# EAGLE design ADXL345 STEMMA QT (EAGLE 9.6.2)
COMPANY: ADAFRUIT INDUSTRIES; DRAWN: KTOWN; REV: A
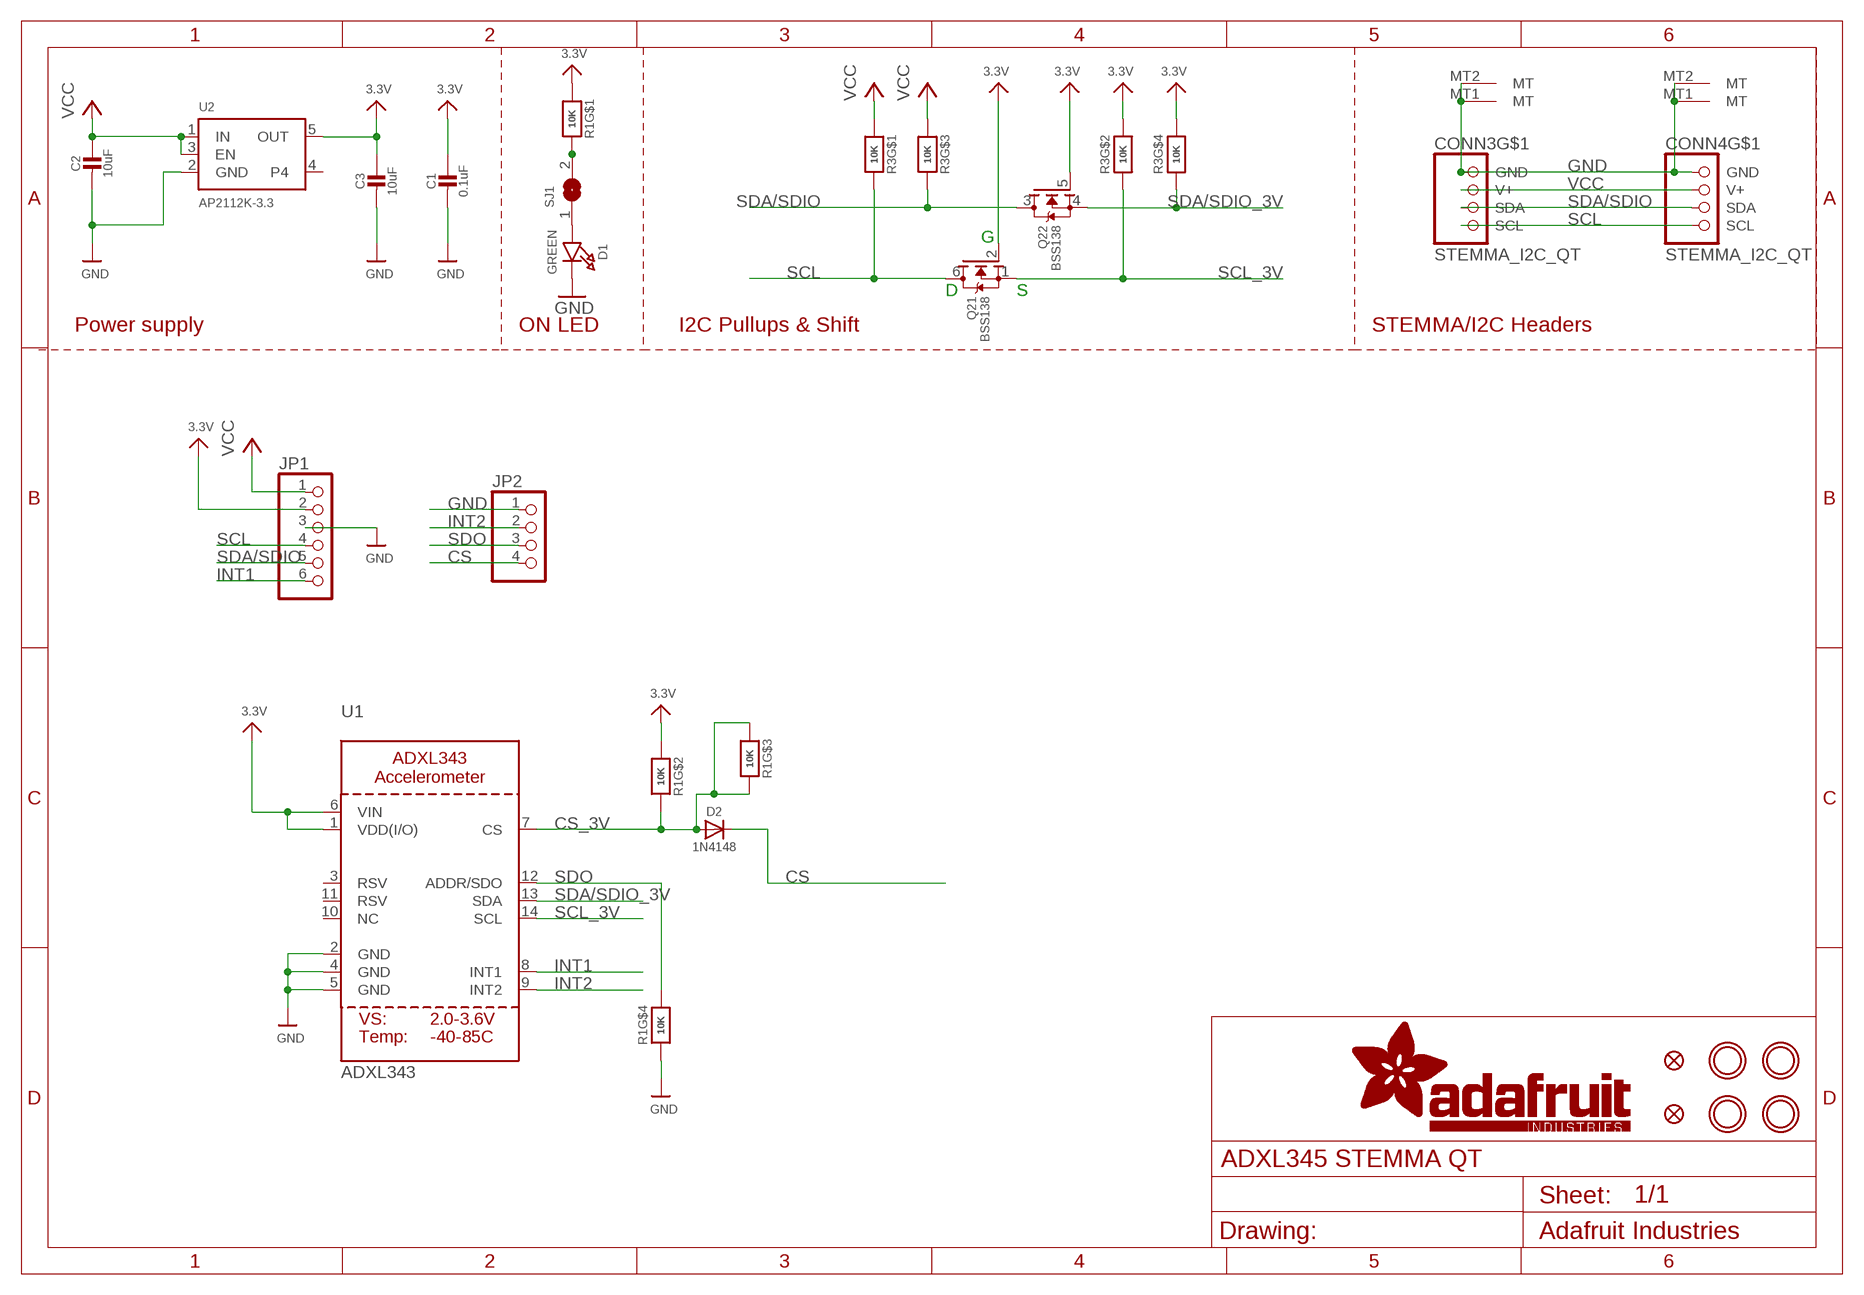
[diagram p0: schematic, sheet 1]

## Parts
C1  0.1uF  CAP_CERAMIC0603_NO  [0603-NO]
C2  10uF  CAP_CERAMIC_0805MP  [_0805MP]
C3  10uF  CAP_CERAMIC0805-NOOUTLINE  [0805-NO]
CONN3  STEMMA_I2C_QT  [JST_SH4]
CONN4  STEMMA_I2C_QT  [JST_SH4]
D1  GREEN  LED0603_NOOUTLINE  [CHIPLED_0603_NOOUTLINE]
D2  1N4148  DIODESOD-323  [SOD-323]
FID3  FIDUCIAL_1MM  [FIDUCIAL_1MM]
FID4  FIDUCIAL_1MM  [FIDUCIAL_1MM]
JP1  HEADER-1X670MIL  [1X06_ROUND_70]
JP2  HEADER-1X4ROUND  [1X04_ROUND]
Q2  BSS138  MOSFET-N_DUAL  [SOT363]
R1  10K  RESISTOR_4PACK  [RESPACK_4X0603]
R3  10K  RESISTOR_4PACK  [RESPACK_4X0603]
SJ1  SOLDERJUMPERCLOSED  [SOLDERJUMPER_CLOSEDWIRE]
U1  ADXL343  ACCEL_ADXL343  [LGA14]
U2  AP2112K-3.3  VREG_SOT23-5  [SOT23-5]
U$1  MOUNTINGHOLE2.5  [MOUNTINGHOLE_2.5_PLATED]
U$17  MOUNTINGHOLE2.5  [MOUNTINGHOLE_2.5_PLATED]
U$19  MOUNTINGHOLE2.5  [MOUNTINGHOLE_2.5_PLATED]
U$21  MOUNTINGHOLE2.5  [MOUNTINGHOLE_2.5_PLATED]

## Nets
3.3V [lowpower]: C1.1 C3.1 JP1.2 Q2.2(1:G) Q2.5(2:G) R1.1 R1.2 R3.2 R3.4 U1.1(VDD(I/O)) U1.6(VIN) U2.5(OUT)
CS: D2.C JP2.4
CS_3V: D2.A R1.3 R1.6 R1.7 U1.7(CS)
GND [highpower]: C1.2 C2.2 C3.2 CONN3.1(GND) CONN3.MT1(MT) CONN3.MT2(MT) CONN4.1(GND) CONN4.MT1(MT) CONN4.MT2(MT) D1.C JP1.3 JP2.1 R1.4 U1.2(GND) U1.4(GND) U1.5(GND) U2.2(GND)
INT1: JP1.6 U1.8(INT1)
INT2: JP2.2 U1.9(INT2)
N$1: R1.8 SJ1.2
N$2: D1.A SJ1.1
SCL: CONN3.4(SCL) CONN4.4(SCL) JP1.4 Q2.6(1:D) R3.8
SCL_3V: Q2.1(1:S) R3.7 U1.14(SCL)
SDA/SDIO: CONN3.3(SDA) CONN4.3(SDA) JP1.5 Q2.3(2:D) R3.6
SDA/SDIO_3V: Q2.4(2:S) R3.5 U1.13(SDA)
SDO: JP2.3 R1.5 U1.12(ADDR/SDO)
VCC [highpower]: C2.1 CONN3.2(V+) CONN4.2(V+) JP1.1 R3.1 R3.3 U2.1(IN) U2.3(EN)
Unconnected: U1.3(RSV) U1.10(NC) U1.11(RSV) U2.4

## Notes on the sheet
- G
- D | S
- Power supply | ON LED | I2C Pullups & Shift | STEMMA/I2C Headers

## Library data of the parts
C1-C3 = microbuilder:CAP_CERAMIC: Ceramic Capacitors For new designs, use the packages preceded by an '_' character since they are more reliable: The following footprints should be used on most boards: _0402 - Standard footprint for regular board layouts _0603 - Standard footprint for regular board layouts _0805 - Standard footprint for regular board layouts _1206 - Standard footprint for regular board layouts For extremely tight-pitch boards where space is at a premium, the following 'micro-pitch' footprints can be used (smaller pads, no silkscreen outline, etc.): _0402MP - Micro-pitch footprint for very dense/compact boards _0603MP - Micro-pitch footprint for very dense/compact boards _0805MP - Micro-pitch footprint for very dense/compact boards _1206MP - Micro-pitch footprint for very dense/compact boards
CONN3 CONN4 = microbuilder:STEMMA_I2C
D1 = microbuilder:LED: LED 0603 - 0603 Surface Mount Package 2mA: Green LED - Low Power (3.9mcd, 2ma, 1.7Vf) - Digikey: 475-2709-2-ND Orange LED - Low Power (9.8mcd, 2ma, 1.8Vf) - Digikey: 475-1194-2-ND Red LED - Low Power (5mcd, 2ma, 1.8Vf) - Digikey: 475-1195-2-ND Yellow LED - Low Power (7mcd, 2ma, 1.8Vf) - Digikey: 475-1196-2-ND 5mA: Blue LED - Low Power (17mcd, 5ma, 2.9Vf) - Digikey: LNJ937W8CRACT-ND 0805 - 0805 Surface Mount Package 2mA: Red LED (8.8mcd, 2mA, 1.8Vf, Clear) - Low Power [Digikey: 475-2510-1-ND] Green LED (5mcd, 2mA, 1.8Vf, Clear) - Low Power [Digikey: 475-2730-1-ND] Yellow LED (11.3mcd, 2mA, 1.8Vf, Clear) - Low Power [Digikey: 475-2555-1-ND] 20mA: Red LED (104mcd, 20mA, Diffused) - LS R976 [Digikey: 475-1278-6-ND] Red LED (12mcd, 20mA, 2.0Vf, Clear) - APT2012EC [Digikey: 754-1128-1-ND] Green LED (15mcd, 20mA, 2.2Vf, Clear) - APT2012GC [Digikey: 754-1131-1-ND] Orange LED (160mcd, 20mA, 2.1Vf, Clear) - APT2012SECK [Digikey: 754-1130-1-ND] 1206 - 1206 Surface Mount Package Green LED (26mcd, 20mA, Diffused) - LG N971 [Digikey: 475-1407-6-ND] Red LED (15mcd, 20mA, Diffused) - LH N974 [Digikey: 475-1416-6-ND] Cree - Cree High-Power Surface Mount LEDs XPEBWT-L1-0000-00D50 - White 111lm 350mA 2.9Vf 6200K 110° XTEAWT-00-0000-00000LEE3 - White 114lm 350mA 2.85Vf 5000K 115° Everlight - Everlight 45-21 Series Surface Mount LEDs 45-21/QK2C-B2832AC2CB2/2T - Warm White 2000mcd 20mA 3.25Vf 3050K 120° 45-21/LK2C-B38452C4CB2/2T - Nuetral White 2000mcd 20mA 3.25Vf 4150K 120° 45-21/LK2C-B50634C6CB2/2T - Cold White 2200mcd 20mA 3.25Vf 5650K 120° PLCC2 Reverse Mount LS T77K-J1L2-1-0-2-R18-Z - Red 11.25mcd 2mA 1.8Vf 630nm 120° LO T77K-L1M2-24-Z - Orange 19.6mcd 2mA 1.8Vf 606nm 120° LY T77K-K2M1-26-Z - Yellow 15.7mcd 2mA 1.8Vf 587nm 120°
D2 = microbuilder:DIODE: Diode SMA Model Volts Amps Type Vf Ir Digikey # Notes SSA34-E3 40V 3A Schottky 480mV @ 3A 200uA @ 40V SSA34-E3/61TGITR-ND CDBA120-G 20V 1A Schottky 500mV @ 1A 500uA @ 20V 641-1014-6-ND REEL MBRA210 10V 2A Schottky 350mV @ 2A 700uA @ 10V MBRA210LT3 SOD-123 Model Volts Amps Type Vf Ir Order # Notes BAT54T1G 30V 200mA Schottky 800mV @ 200mA 2uA @ 25V BAT54T1GOSTR-ND B0530W 30V 500mA Schottky 430mV @ 500mA 130uA @ 30V B0530W-FDICT-ND REEL MBR120 20V 1A Schottky 340mV @ 1A MBR120VLSFT1GOSCT-ND SOD-323 Model Volts Amps Type Vf Ir Order # Notes PMEG2005EJ 20V 500mA Schottky 355mV @ 500mA 568-4110-1-ND ZLLS410 10V 570mA Schottky 380mV @ 570mA ZLLS410CT-ND 1N4148WS 75V 150mA Silicon/Simple 1V 1N4148WSFSCT-ND REEL SOD-523 Model Volts Amps Type Vf Ir Order # Notes BAT54XV2 30V 200mA Schottky 0.8V @ 100mA BAT54XV2CT-ND TB751S 30V 30mA Schottky RB751S-40TE61CT-ND SOT23-R/W (R = Solder Paste/Reflow Ovens, W = Hand-Soldering) Model Volts Amps Type Vf Ir Order # Notes BAT54FILM 40V 300mA Schottky 497-7162-1-ND POWERDI-5 Model Volts Amps Type Vf Ir Order # Notes PDS560 60V 5A Schottky 670mV @ 5A 150uA @ 60V PDS560DICT-ND
FID3 FID4 = microbuilder:FIDUCIAL: Fiducial Alignment Points Various fiducial points for machine vision alignment.; BOM: EXCLUDE
JP1 = microbuilder:HEADER-1X6: PIN HEADER
JP2 = microbuilder:HEADER-1X4: PIN HEADER
Q2 = microbuilder:MOSFET-N_DUAL: Dual N-Channel MOSFET SOT363 (2.0x1.25mm) 2N7002PS - 60V, 320mA [Digikey: 568-5984-1-ND]
R1 R3 = microbuilder:RESISTOR_4PACK: Resistor Packs (4 resistors) 4 x 0603 10K 1/16W - Digikey: YC164J-10KCT-ND
SJ1 = microbuilder:SOLDERJUMPER: SMD Solder JUMPER Solder the two pads together to create a connection, or remove the solder to break it. REFLOW - Use this footprint for solder paste and reflow ovens. WAVE - Use this footprint for hand-soldering (larger pads). CLOSED - Has a trace between the two pads to ensure it is closed by default. The trace needs to be cut to disable the jumper, and can be closed again by creating a solder bridge between the two pads.
U1 = microbuilder:ACCEL_ADXL343: ADXL343 - Digital Accelerometer 2/4/8/16g
U2 = adafruit_power:VREG_SOT23-5: SOT23-5 Fixed Voltage Regulators Part Current Out V Out V In V Dropout θJA (°C/W) TJ (°C) Digikey Part No. ADP121 150mA 3.3V 3.4-5.5V 0.09V @ 150mA -- -- ADP121-AUJZ33R7CT-ND ADP121 150mA 3.0V 3.1-5.5V 0.09V @ 150mA -- -- ADP121-AUJZ30R7CT-ND ADP122 300mA 3.3V 3.4-5.5V 0.085V @ 300mA -- -- ADP122AUJZ-3.3-R7CT-ND ADP1712 300mA 3.3V 3.5-5.5V 0.17V @ 300mA -- -- ADP1712AUJZ-3.3-R7TR-ND AP7311 (Low Cost) 150mA 3.3V 3.5-6V 0.15V @ 150mA -- -- AP7311-33WG-7DICT-ND LD39015M18R 150mA 1.8V 1.9V-5.5V 0.08V @ 100mA -- -- 497-6977-1-ND LP2985A-33DBVR 150mA 3.3V 3.3-16V 0.28V @ 150mA 206 150 296-18479-1-ND MCP1824T-3302E/OT 300mA 3.3V 3.5V-6V 0.2V @ 300mA -- -- MCP1824T-3302E/OTCT-ND MIC5205-2.5YM5 TR 150mA 2.5V 2.7-16V 0.165V @ 150mA -- -- 576-1257-2-ND MIC5205-3.0YM5 TR 150mA 3.0V 3.2V-16V 0.165V @ 150mA -- -- 576-1258-2-ND MIC5205-3.3YM5 TR 150mA 3.3V 3.5V-16V 0.165V @ 150mA -- -- 576-1259-2-ND TPS780330220 150mA 3.3V+2.2V 3.6-5.5V 250mV Max -- -- 296-23332-1-ND TDA3663/N1,135 100mA 3.3V 3.5-45V 0.18V @ 50mA -- -- 568-5343-1-ND Max operating temp can be calculated using θJA, TJ (max junction temperature), and power in watts. Set the "Maximum Ambient Temperature" until it reaches TJ ("Max Junction Temperature"), which is the absolute limit for safe use of the regulator: Heat Sink Temperature Calculator <http://www.daycounter.com/Calculators/Heat-Sink-Temperature-Calculator.phtml> For example, With 12V source into a 3.3V LP2985 and a 30mA load, we are dissipating (12V-3.3V) * 0.03A = 0.261W. With a θJA of 206 °C/W, a TJ of 150°C, and 261mW we can safely use the chip without a heat sink up to 75°C (=147.1°C Junction Temperature).
U$1 U$17 U$19 U$21 = adafruit_electromech:MOUNTINGHOLE: Mounting Hole For #2 screws (0.086"/2.18mm width, 0.094"/2.4mm hole) use 2.5mm; BOM: EXCLUDE

## Net classes
1 highpower: width 0.305 mm, drill 0.483 mm
2 lowpower: width 0.254 mm, drill 0.483 mm

## Board
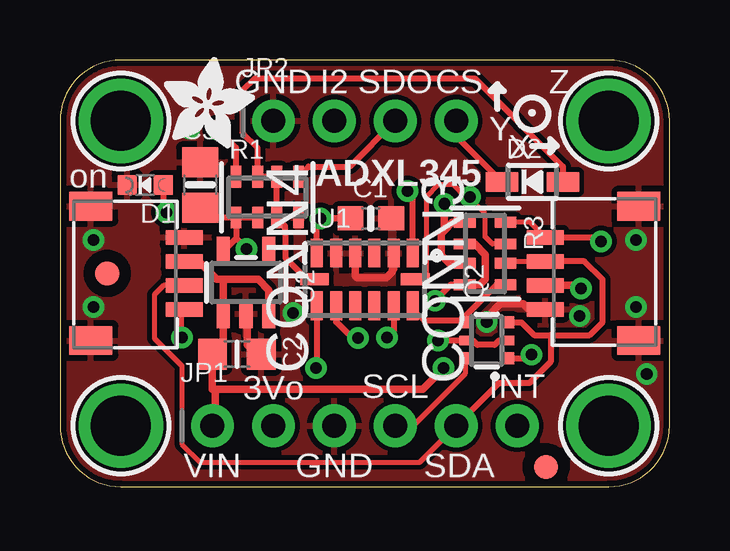
[diagram p1: board, top side]
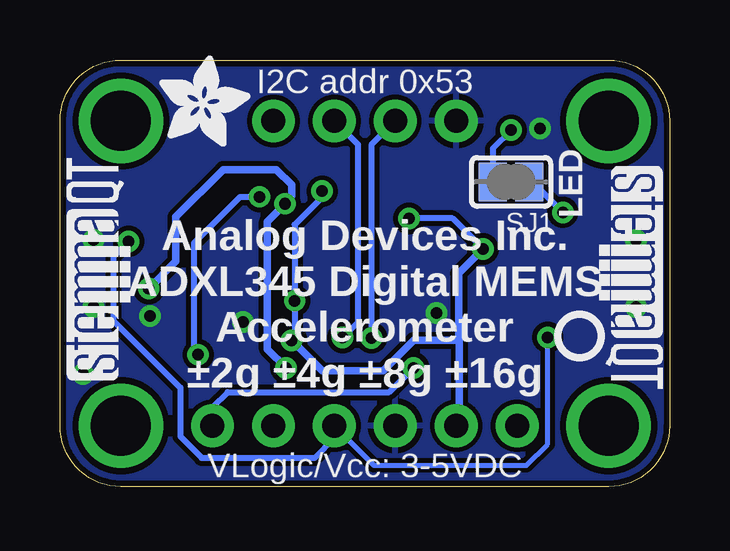
[diagram p2: board, bottom side, seen from below]

Size 25.4 x 17.78 mm. Coordinates in mm from the lower left corner, seen from the top.
Outline: 0,15.24 0,2.54 arc90 2.54,0 22.86,0 arc90 25.4,2.54 25.4,15.24 arc90 22.86,17.78 2.54,17.78 arc90 0,15.24
Copper layers (1*16): Top 0.035mm / dielectric 1.5mm / Bottom 0.035mm
Design rules "adafruit *": minimum track width 8mil, minimum drill 15.5mil, track to track 8mil, track to pad 8mil, pad to pad 8mil, via to via 8mil, smd to smd 8mil, copper to edge 10mil, drill to drill 8mil, minimum pad ring 10mil, minimum via ring 8mil, stop-mask expansion 2mil, vias tented up to drill 20mil, thermal gap 10mil

### Footprints (pad centres in the part's own frame; a part is rotated, then mirrored left to right if it is on the bottom)
0603-NO = smd 1.075 x 1: 1 -0.85,0; 2 0.85,0
_0805MP = smd 1.2 x 1.3: 1 -1.016,0; 2 1.016,0
0805-NO = smd 1.24 x 1.5: 1 -0.95,0; 2 0.95,0
JST_SH4 = smd 0.6 x 1.55: 1 -1.5,2.514; 2 -0.5,2.514; 3 0.5,2.514; 4 1.5,2.514 | smd 1.2 x 1.8: MT1 -2.8,-1.386; MT2 2.8,-1.386
CHIPLED_0603_NOOUTLINE = smd 0.8 x 0.8: A 0,-0.75; C 0,0.75
SOD-323 = smd 1.35 x 0.8: A 1.27,0; C -1.27,0
FIDUCIAL_1MM = smd 1 x 1: 1 0,0
1X06_ROUND_70 = drill 1 pad 1.778: 1 -6.35,0; 2 -3.81,0; 3 -1.27,0; 4 1.27,0; 5 3.81,0; 6 6.35,0
1X04_ROUND = drill 1 pad 1.778: 1 -3.81,0; 2 -1.27,0; 3 1.27,0; 4 3.81,0
SOT363 = smd 0.5 x 0.5: 1 -0.75,-0.9; 3 0.75,-0.9; 4 0.75,0.9; 6 -0.75,0.9 | smd 0.4 x 0.5: 2 0,-0.9; 5 0,0.9
RESPACK_4X0603 = smd 0.45 x 0.9: 1 -1.3,-0.85; 2 -0.4,-0.85; 3 0.4,-0.85; 4 1.3,-0.85; 5 1.3,0.85; 6 0.4,0.85; 7 -0.4,0.85; 8 -1.3,0.85
SOLDERJUMPER_CLOSEDWIRE = smd 1.168 x 1.6: 1 -0.762,0; 2 0.762,0 | smd 0.635 x 0.203: WIRE 0,0
LGA14 = smd 0.5 x 1.2: 1 2,1.1; 2 1.2,1.1; 3 0.4,1.1; 4 -0.4,1.1; 5 -1.2,1.1; 6 -2,1.1; 8 -2,-1.1; 9 -1.2,-1.1; 10 -0.4,-1.1; 11 0.4,-1.1; 12 1.2,-1.1; 13 2,-1.1 | smd 1.2 x 0.5: 7 -2.1,0; 14 2.1,0
SOT23-5 = smd 0.55 x 1.2: 1 -0.95,-1.3; 2 0,-1.3; 3 0.95,-1.3; 4 0.95,1.3; 5 -0.95,1.3
MOUNTINGHOLE_2.5_PLATED = drill 2.5 pad 3.2: P$1 0,0

### Placement (x,y rotation side)
C1  12.95,11.18 0 top
C2  7.37,5.52 0 top
C3  5.84,12.57 90 top
CONN3  22.73,8.89 90 top
CONN4  2.67,8.89 270 top
D1  3.56,12.57 90 top
D2  19.68,12.7 0 top
FID3  20.26,0.83 0 top
FID4  1.97,8.89 0 top
JP1  12.7,2.54 0 top
JP2  12.7,15.24 0 top
Q2  17.78,6.1 90 top
R1  8.64,12.06 0 top
R3  17.72,9.72 270 top
SJ1  6.6,12.7 180 bottom
U1  12.7,8.64 0 top
U2  7.75,8.51 0 top
U$1  2.54,15.24 0 top
U$4  [ADAFRUIT_3.5MM]  4.32,14.1 0 top
U$11  [ADAFRUIT_3.5MM]  21.27,14.16 0 bottom
U$17  22.86,15.24 0 top
U$19  2.54,2.54 0 top
U$21  22.86,2.54 0 top
U$25  [PCBFEAT-REV-040]  3.75,6.29 0 bottom
U$30  [STEMMAQT]  22.48,4.45 90 bottom
U$31  [STEMMAQT]  2.92,13.34 270 bottom

### Tracks (layer width: path | path; a pad name or v marks a point on that pad's centre or on a via)
3.3V  (via drill 0.48)
  Top 0.254: Q2.2 18.3,6.1 18.11,5.91 17.39,5.91 17.2,6.1 Q2.5 v15.75,6.1 | U1.6 10.7,10.79 11.09,11.18 C1.1 v10.86,11.18 | R1.2 R1.1 | R1.1 6.25,11.21 C3.1 | U2.5 7.34,10.35 | R1.1 7.34,10.35 | 7.34,10.35 7.34,10.34 v7.77,9.91 | R3.4 16.29,8.41 v15.62,7.75 | U1.1 14.7,12.1 v14.48,12.32
  Top 0.305: R3.2 17.27,10.12 17.72,9.67 17.72,8.64 17.5,8.41 R3.4
  Bottom 0.254: v7.77,9.91 9.04,11.18 v10.86,11.18 | v15.75,6.1 15.62,6.22 v15.62,7.75 15.62,10.92 14.48,12.06 v14.48,12.32 | 9.53,6.1 8.76,6.1
  Bottom 0.305: v15.75,6.1 14.48,4.83 11.94,4.83 10.67,6.1 9.53,6.1 8.79,6.1 8.79,8.89 v7.77,9.91 | 8.76,6.1 8.76,2.67 JP1.2
CS
  Top 0.254: D2.C 16.51,14.61 JP2.4
CS_3V
  Top 0.254: U1.7 10.29,8.64 9.4,9.53 9.4,10.61 9.38,10.63 9.38,10.87 R1.3 R1.6 R1.7 8.24,14.12 7.62,14.73 7.62,16.51 8.13,17.02 17.27,17.02 20.95,13.34 D2.A
GND  (via drill 0.48)
  Top 0.305: v17.78,6.86 17.78,7.05 18.35,7.62 19.3,7.62 19.53,7.39 CONN3.1 | U2.2 7.81,7.14 7.81,5.91 8.19,5.52 C2.2 | U1.2 13.9,9.09 13.84,9.03 13.84,8.96 13.59,8.7 12.38,8.7 12.3,8.78 U1.4
  other vias: 1.4,10.29 1.4,7.49 5.4,14.92 24,10.29 24,7.49 9.72,7.24 21.65,7.11 24.45,4.7
  pour Top: 0,17.78 25.4,17.78 25.4,0 0,0
  pour Bottom: 0,17.78 25.4,17.78 25.4,0 0,0
INT1  (via drill 0.48)
  Top 0.254: U1.8 10.7,4.99 v10.67,4.95
  Bottom 0.254: v10.67,4.95 11.68,3.94 18.41,3.94 19.05,3.3 JP1.6
INT2  (via drill 0.48)
  Top 0.254: U1.9 11.5,6.87 12.17,6.2 v12.42,6.2
  Bottom 0.254: v12.42,6.2 12.42,14.25 JP2.2
N$1  (via drill 0.48)
  Top 0.254: R1.8 7.34,14.13 v6.6,14.86
  Bottom 0.254: v6.6,14.86 7.37,14.1 SJ1.2
N$2  (via drill 0.48)
  Top 0.254: D1.A 4.31,11.57 v4.44,11.43
  Bottom 0.254: v4.44,11.43 5.71,12.7 SJ1.1
SCL  (via drill 0.48)
  Top 0.203: CONN3.4 19.59,11.02 R3.8 | Q2.6 16.88,4.71 14.71,2.54 JP1.4 | v5.08,6.22 5.08,7.29 CONN4.4
  Top 0.254: CONN3.4 22.38,10.39 v22.54,10.22
  Bottom 0.203: JP1.4 12.32,0.89 5.97,0.89 5.08,1.78 v5.08,6.22
  Bottom 0.254: v22.54,10.22 23.18,9.59 23.18,6.92 20.38,4.13 20.38,2.1 19.49,1.21 14.8,1.21 13.97,2.03 JP1.4
SCL_3V  (via drill 0.48)
  Top 0.203: R3.7 18.02,10.12 17.72,10.41 17.72,11.37 17.08,12 v17.08,12.08 16.89,12.08 16.4,12.57 15.75,12.57 15.26,12.08 15.26,8.64 U1.14
  Top 0.254: Q2.1 19.49,5.35 v19.64,5.5
  Bottom 0.254: v19.64,5.5 19.81,5.67 19.81,10.16 17.89,12.08 v17.08,12.08
SDA/SDIO
  Top 0.203: R3.6 18.64,9.39 CONN3.3 | CONN4.3 4.33,8.39 3.94,8 3.94,6.18 5.08,5.04 5.08,1.78 5.84,1.02 14.99,1.02 JP1.5
  Top 0.254: Q2.3 19.22,6.85 19.75,6.32 20.45,6.32 | 20.45,6.32 22.06,6.32 22.61,6.86 22.61,8.64 21.85,9.39 CONN3.3 | 20.45,6.32 20.45,5.21 19.56,4.32 18.29,4.32 JP1.5
SDA/SDIO_3V
  Top 0.254: U1.13 14.7,7.4 15.19,6.91 16.82,6.91 Q2.4 16.88,7.1 18.2,8.41 R3.5
SDO  (via drill 0.48)
  Top 0.254: U1.12 13.9,6.49 v13.62,6.21 | R1.5 10.36,13.34 12.06,13.34 JP2.3
  Bottom 0.254: v13.62,6.21 12.99,6.85 12.99,14.26 JP2.3
VCC  (via drill 0.48)
  Top 0.305: R3.3 16.21,9.32 15.88,9.65 15.88,10.54 16,10.67 | 16,10.67 16.35,11.02 R3.1 | CONN3.2 21.57,8.39 v21.7,8.26 | U2.3 8.7,8.19 8.26,8.64 6.86,8.64 | CONN4.2 5.78,9.39 6.53,8.64 6.86,8.64 | 6.86,8.64 6.8,8.57 U2.1 6.8,5.97 C2.1 6.35,4.06 6.48,4.06 | 6.48,4.06 6.48,2.67 JP1.1 | v16.02,11.79 16,11.77 16,10.67 | 6.48,4.06 15.11,4.06 15.98,4.93 v15.98,4.95
  Bottom 0.305: v21.7,8.26 20.57,9.38 20.57,11.24 18.61,13.21 16.38,13.21 15.75,12.57 15.75,12.13 16.02,11.85 v16.02,11.79 16.76,11.05 16.76,5.74 v15.98,4.95

### Text on the board
tPlace: GND | I2 | SDO | CS | Z | Y | X | ADXL345 | on | 3Vo | SCL | INT | VIN | GND | SDA
bPlace: I2C addr 0x53 | LED | Analog Devices Inc. / ADXL345 Digital MEMS / Accelerometer / ±2g ±4g ±8g ±16g | VLogic/Vcc: 3-5VDC